# Altium project Buoy_Board_Power_Setup.PrjPcb
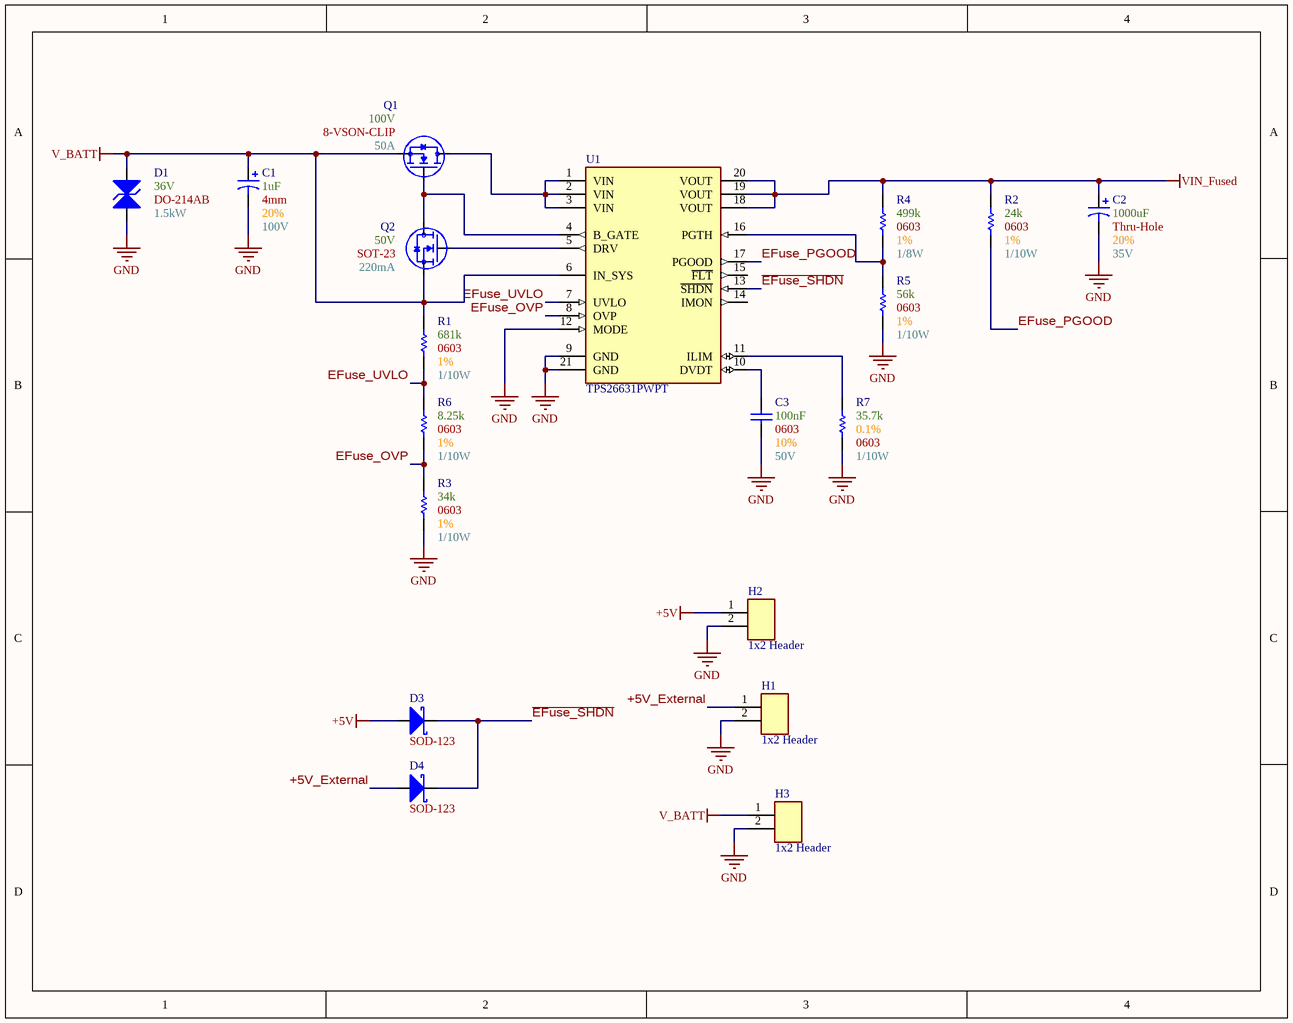
[diagram p0: E-Fuse.SchDoc]
2 sheets, 37 parts. Net scope: global (net labels, ports and power ports of the same name join across sheets).
Sheets:
  E-Fuse.SchDoc
  Regulator.SchDoc

## Sheet E-Fuse.SchDoc
size A; SheetNumber: 1; SheetTotal: 2

### Parts
C1  Max Voltage: 100V  Size Package: 4mm  Tolerance: 20%  Capacitance: 1uF  [[Cap] SMD Polarized, 4mm]  (hidden comment: [Cap] 4mm 1uF 20% 100V)
C2  Max Voltage: 35V  Size Package: Thru-Hole  Tolerance: 20%  Capacitance: 1000uF  [[Cap] Thru-Hole Polarized 10mm]  (hidden comment: [Cap] Thru-Hole 1000uF 20% 35V)
C3  Max Voltage: 50V  Size Package: 0603  Tolerance: 10%  Capacitance: 100nF  [[Cap] SMD 0603]  (hidden comment: [Cap] 0603 0.1uF 10% 50V)
D1  Wattage: 1.5kW  Optimal Zener Voltage: 36V  [[Diode] SMD DO-214AB]  (hidden comment: DO-214AB)
D3  Footprint: SOD-123  [[Diode] SMD SOD-123]  (hidden comment: SOD123)
D4  Footprint: SOD-123  [[Diode] SMD SOD-123]  (hidden comment: SOD123)
H1  1x2 Header  [[Header] 1x2 Male]
H2  1x2 Header  [[Header] 1x2 Male]
H3  1x2 Header  [[Header] 1x2 Male]
Q1  IDS_Max: 50A  VDS_Max: 100V  [8-VSON-CLIP]  (hidden comment: CSD19537Q3)
Q2  IDS_Max: 220mA  VDS_Max: 50V  [SOT-23]  (hidden comment: [NMOS] SMD 50V 220mA 3mOhm)
R1  Wattage: 1/10W  Tolerance: 1%  Resistance: 681k  Size Package: 0603  [[Res] SMD 0603]  (hidden comment: [681k] SMD 0603 1% 1/10W)
R2  Wattage: 1/10W  Tolerance: 1%  Resistance: 24k  Size Package: 0603  [[Res] SMD 0603]  (hidden comment: [24k] SMD 0603 1% 1/10W)
R3  Wattage: 1/10W  Tolerance: 1%  Resistance: 34k  Size Package: 0603  [[Res] SMD 0603]  (hidden comment: [34k] SMD 0603 1% 1/10W)
R4  Wattage: 1/8W  Tolerance: 1%  Resistance: 499k  Size Package: 0603  [[Res] SMD 0603]  (hidden comment: [499k] SMD 0603 1% 1/8W)
R5  Wattage: 1/10W  Tolerance: 1%  Resistance: 56k  Size Package: 0603  [[Res] SMD 0603]  (hidden comment: [56k] SMD 0603 1% 1/10W)
R6  Wattage: 1/10W  Tolerance: 1%  Resistance: 8.25k  Size Package: 0603  [[Res] SMD 0603]  (hidden comment: [8.25k] SMD 0603 1% 1/10W)
R7  Wattage: 1/10W  Tolerance: 0.1%  Resistance: 35.7k  Size Package: 0603  [[Res] SMD 0603]  (hidden comment: [35.7k] SMD 0603 0.1% 1/10W)
U1  TPS26631PWPT  [[E-Fuse] 4.5-60V 6A]

### Nets
+5V: D3.2(A) H2.1
GND: C1.2 C2.2 C3.1 D1.2(A) H1.2 H2.2 H3.2 R3.1 R5.1 R7.1 U1.9(GND) U1.12(MODE) U1.21(GND)  [project net +5V Reg SYNC]
V_BATT: C1.1 D1.1(K) H3.1 Q1.2(Source) Q2.2(Source) R1.2 U1.6(IN_SYS)
VIN_Fused: C2.1 R2.2 R4.2 U1.18(VOUT) U1.19(VOUT) U1.20(VOUT)
+5V_External: D4.2(A) H1.1
~{EFuse_SHDN}: D3.1(K) D4.1(K) U1.13(~{SHDN})
EFuse_OVP: R3.2 R6.1 U1.8(OVP)
EFuse_PGOOD: R2.1 U1.17(PGOOD)
EFuse_UVLO: R1.1 R6.2 U1.7(UVLO)
NetC3_2: C3.2 U1.10(DVDT)
NetQ1_1: Q1.1(Gate) Q2.3(Drain) U1.4(B_GATE)
NetQ1_3: Q1.3(Drain) U1.1(VIN) U1.2(VIN) U1.3(VIN)
NetQ2_1: Q2.1(Gate) U1.5(DRV)
NetR4_1: R4.1 R5.2 U1.16(PGTH)
NetR7_2: R7.2 U1.11(ILIM)

Not connected (* = marked no-connect by the designer): U1 14(IMON) 15(~{FLT})

### Library data of the parts
C1 = [Cap] 4mm 1uF 20% 100V: 865080840001; Supplier 1: DigiKey; Supplier Part Number 1: 732-865080840001CT-ND
C2 = [Cap] Thru-Hole 1000uF 20% 35V: 35PK1000MEFC10X20; Supplier 1: DigiKey; Supplier Part Number 1: 1189-1742-ND
C3 = [Cap] 0603 0.1uF 10% 50V: CL10B104KB8NNNC; Supplier 1: DigiKey; Supplier Part Number 1: 1276-1000-6-ND
D1 = [TVS] 36Vnom 40Vclamp_max: SMCJ36CA; Supplier 1: DigiKey; Supplier Part Number 1: SMCJ36CALFDKR-ND; Footprint: DO-214AB
D3 D4 = [Schottky] SMD 40V 1A: B5819W-TP; Supplier 1: DigiKey; Supplier Part Number 1: B5819W-TPMSCT-ND
H1-H3 = [Header] 1x2 Male: 2.54mm pitch
Q1 = [NMOS] SMD 100V 50A 14.5mOhm: Supplier 1: DigiKey; Supplier Part Number 1: 296-44351-6-ND; Package: 8-VSON-CLIP
Q2 = [NMOS] SMD 50V 220mA 3mOhm: BSS138; Supplier 1: DigiKey; Supplier Part Number 1: BSS138DKR-ND; Package: SOT-23
R1 = [681k] SMD 0603 1% 1/10W: RT0603FRE07681KL; Supplier 1: DigiKey; Supplier Part Number 1: 13-RT0603FRE07681KLCT-ND
R2 = [24k] SMD 0603 1% 1/10W: RC0603FR-1324KL; Supplier 1: DigiKey; Supplier Part Number 1: 13-RC0603FR-1324KLCT-ND
R3 = [34k] SMD 0603 1% 1/10W: RC0603FR-1334KL; Supplier 1: DigiKey; Supplier Part Number 1: 13-RC0603FR-1334KLDKR-ND
R4 = [499k] SMD 0603 1% 1/8W: CRCW0603499KFKEA; Supplier 1: DigiKey; Supplier Part Number 1: 541-499KHDKR-ND
R5 = [56k] SMD 0603 1% 1/10W: CRGCQ0603F56K; Supplier 1: DigiKey; Supplier Part Number 1: A129709CT-ND
R6 = [8.25k] SMD 0603 1% 1/10W: AF0603FR-078K25L; Supplier 1: DigiKey; Supplier Part Number 1: 13-AF0603FR-078K25LCT-ND
R7 = [35.7k] SMD 0603 0.1% 1/10W: RT0603BRE0735K7L; Supplier 1: DigiKey; Supplier Part Number 1: YAG4707CT-ND
U1 = [E-Fuse] 4.5-60V 6A

## Sheet Regulator.SchDoc
size A; SheetNumber: 2; SheetTotal: 2
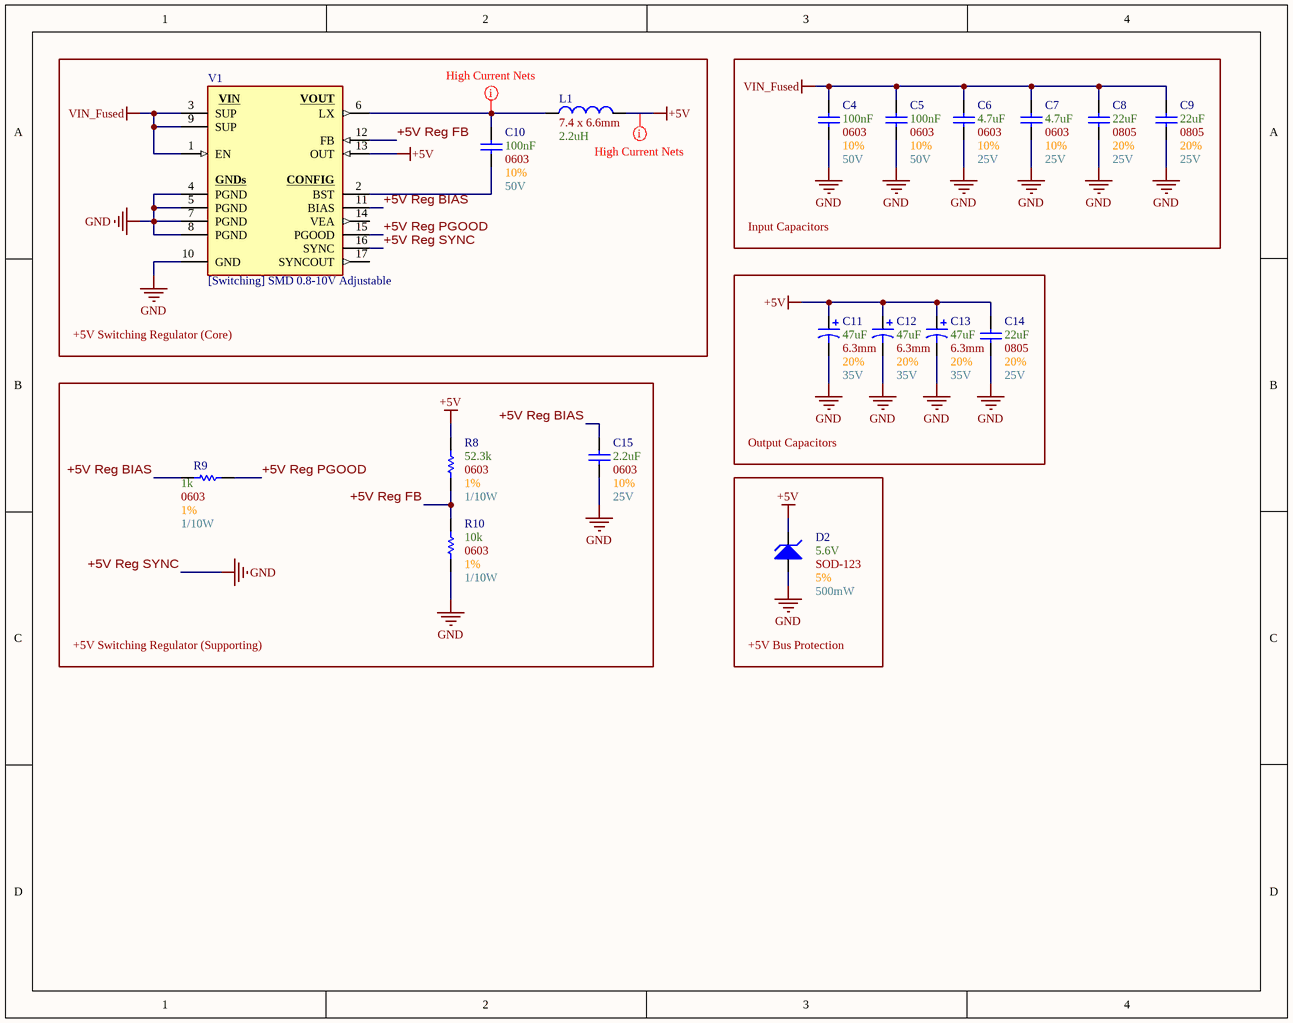
[diagram p1: Regulator.SchDoc]

### Parts
C4  Max Voltage: 50V  Size Package: 0603  Tolerance: 10%  Capacitance: 100nF  [[Cap] SMD 0603]  (hidden comment: [Cap] 0603 0.1uF 10% 50V)
C5  Max Voltage: 50V  Size Package: 0603  Tolerance: 10%  Capacitance: 100nF  [[Cap] SMD 0603]  (hidden comment: [Cap] 0603 0.1uF 10% 50V)
C6  Max Voltage: 25V  Size Package: 0603  Tolerance: 10%  Capacitance: 4.7uF  [[Cap] SMD 0603]  (hidden comment: [Cap] 0603 4.7uF 10% 25V)
C7  Max Voltage: 25V  Size Package: 0603  Tolerance: 10%  Capacitance: 4.7uF  [[Cap] SMD 0603]  (hidden comment: [Cap] 0603 4.7uF 10% 25V)
C8  Max Voltage: 25V  Size Package: 0805  Tolerance: 20%  Capacitance: 22uF  [[Cap] SMD 0805]  (hidden comment: [Cap] 0805 22uF 20% 25V)
C9  Max Voltage: 25V  Size Package: 0805  Tolerance: 20%  Capacitance: 22uF  [[Cap] SMD 0805]  (hidden comment: [Cap] 0805 22uF 20% 25V)
C10  Max Voltage: 50V  Size Package: 0603  Tolerance: 10%  Capacitance: 100nF  [[Cap] SMD 0603]  (hidden comment: [Cap] 0603 0.1uF 10% 50V)
C11  Max Voltage: 35V  Size Package: 6.3mm  Tolerance: 20%  Capacitance: 47uF  [[Cap] SMD Polarized, 6.3mm]  (hidden comment: [Cap] 6.3mm 47uF 20% 35V)
C12  Max Voltage: 35V  Size Package: 6.3mm  Tolerance: 20%  Capacitance: 47uF  [[Cap] SMD Polarized, 6.3mm]  (hidden comment: [Cap] 6.3mm 47uF 20% 35V)
C13  Max Voltage: 35V  Size Package: 6.3mm  Tolerance: 20%  Capacitance: 47uF  [[Cap] SMD Polarized, 6.3mm]  (hidden comment: [Cap] 6.3mm 47uF 20% 35V)
C14  Max Voltage: 25V  Size Package: 0805  Tolerance: 20%  Capacitance: 22uF  [[Cap] SMD 0805]  (hidden comment: [Cap] 0805 22uF 20% 25V)
C15  Max Voltage: 25V  Size Package: 0603  Tolerance: 10%  Capacitance: 2.2uF  [[Cap] SMD 0603]  (hidden comment: [Cap] 0603 2.2uF 10% 25V)
D2  Tolerance: 5%  Wattage: 500mW  Optimal Zener Voltage: 5.6V  [[Diode] SMD SOD-123]  (hidden comment: SOD-123)
L1  Package: 7.4 x 6.6mm  Inductance: 2.2uH  [[Inductor] SMD 7.4 X 6.6 X 3 MM]  (hidden comment: [2.2uH] SMD Nonstandard 10A)
R8  Wattage: 1/10W  Tolerance: 1%  Resistance: 52.3k  Size Package: 0603  [[Res] SMD 0603]  (hidden comment: [52.3k] SMD 0603 1% 1/10W)
R9  Wattage: 1/10W  Tolerance: 1%  Resistance: 1k  Size Package: 0603  [[Res] SMD 0603]  (hidden comment: [1k] SMD 0603 1% 1/10W)
R10  Wattage: 1/10W  Tolerance: 1%  Resistance: 10k  Size Package: 0603  [[Res] SMD 0603]  (hidden comment: [10k] SMD 0603 1% 1/8W)
V1  [Switching] SMD 0.8-10V Adjustable  [[Switching] 0.8-10V Adjustable Buck]

### Blocks framed on the sheet
+5V Switching Regulator (Core): C10 L1 V1
Input Capacitors: C4-C9
Output Capacitors: C11-C14
+5V Switching Regulator (Supporting): C15 R8-R10
+5V Bus Protection: D2

### Nets
+5V: C11.1 C12.1 C13.1 C14.2 D2.1(K) L1.2 R8.2 V1.13(OUT)
+5V Reg SYNC: C4.1 C5.1 C6.1 C7.1 C8.1 C9.1 C11.2 C12.2 C13.2 C14.1 C15.1 D2.2(A) R10.1 V1.4(PGND) V1.5(PGND) V1.7(PGND) V1.8(PGND) V1.10(GND) V1.16(SYNC)  [also labelled GND]
VIN_Fused: C4.2 C5.2 C6.2 C7.2 C8.2 C9.2 V1.1(EN) V1.3(SUP) V1.9(SUP)
+5V Reg BIAS: C15.2 R9.1 V1.11(BIAS)
+5V Reg FB: R8.1 R10.2 V1.12(FB)
+5V Reg PGOOD: R9.2 V1.15(PGOOD)
NetC10_1: C10.1 V1.2(BST)
NetC10_2: C10.2 L1.1 V1.6(LX)

Not connected (* = marked no-connect by the designer): V1 14(VEA) 17(SYNCOUT)

### Layout directives
net class High_Current_Nets: +5V, NetC10_2

### Notes on the sheet
- (in symbol [Switching] SMD 0.8-10V Adjustable) VIN; VOUT; GNDs; CONFIG

### Library data of the parts
C4 C5 C10 = [Cap] 0603 0.1uF 10% 50V: CL10B104KB8NNNC; Supplier 1: DigiKey; Supplier Part Number 1: 1276-1000-6-ND
C6 C7 = [Cap] 0603 4.7uF 10% 25V: GRM188R61E475KE11D; Supplier 1: DigiKey; Supplier Part Number 1: 490-7203-6-ND
C8 C9 C14 = [Cap] 0805 22uF 20% 25V: CL21A226MAYNNWE; Supplier 1: DigiKey; Supplier Part Number 1: 1276-CL21A226MAYNNWECT-ND
C11-C13 = [Cap] 6.3mm 47uF 20% 35V: UWT1V470MCL1GS; Supplier 1: DigiKey; Supplier Part Number 1: 493-2202-1-ND
C15 = [Cap] 0603 2.2uF 10% 25V: GRM188R61E225KA12D; Supplier 1: DigiKey; Supplier Part Number 1: 490-10731-1-ND
D2 = [Zener] SMD 5.6V 1/2W 5%: CMHZ5232B TR PBFREE; Supplier 1: DigiKey; Footprint: SOD-123; Supplier Part Number 1: 1514-CMHZ5232BTRPBFREEDKR-ND
L1 = [2.2uH] SMD Nonstandard 10A: ECS-MPIL0630-2R2MC; Supplier 1: DigiKey; Supplier Part Number 1: XC2402CT-ND
R8 = [52.3k] SMD 0603 1% 1/10W: RC0603FR-0752K3L; Supplier 1: DigiKey; Supplier Part Number 1: 311-52.3KHRCT-ND
R9 = [1k] SMD 0603 1% 1/10W: RMCF0603FT1K00; Supplier 1: DigiKey; Supplier Part Number 1: RMCF0603FT1K00DKR-ND
R10 = [10k] SMD 0603 1% 1/8W: RMCF0603FT10K0; Supplier 1: DigiKey; Supplier Part Number 1: RMCF0603FT10K0DKR-ND
V1 = [Switching] SMD 0.8-10V Adjustable: MAX20408AFOF/VY+; Supplier 1: DigiKey; Supplier Part Number 1: 505-MAX20408AFOF/VY+-ND

## Nets that join several sheets
+5V: E-Fuse (D3.2 H2.1), Regulator (8 pins)
+5V Reg SYNC: E-Fuse (13 pins), Regulator (19 pins)
VIN_Fused: E-Fuse (6 pins), Regulator (9 pins)